# EAGLE design PCB (EAGLE 9.4.2)
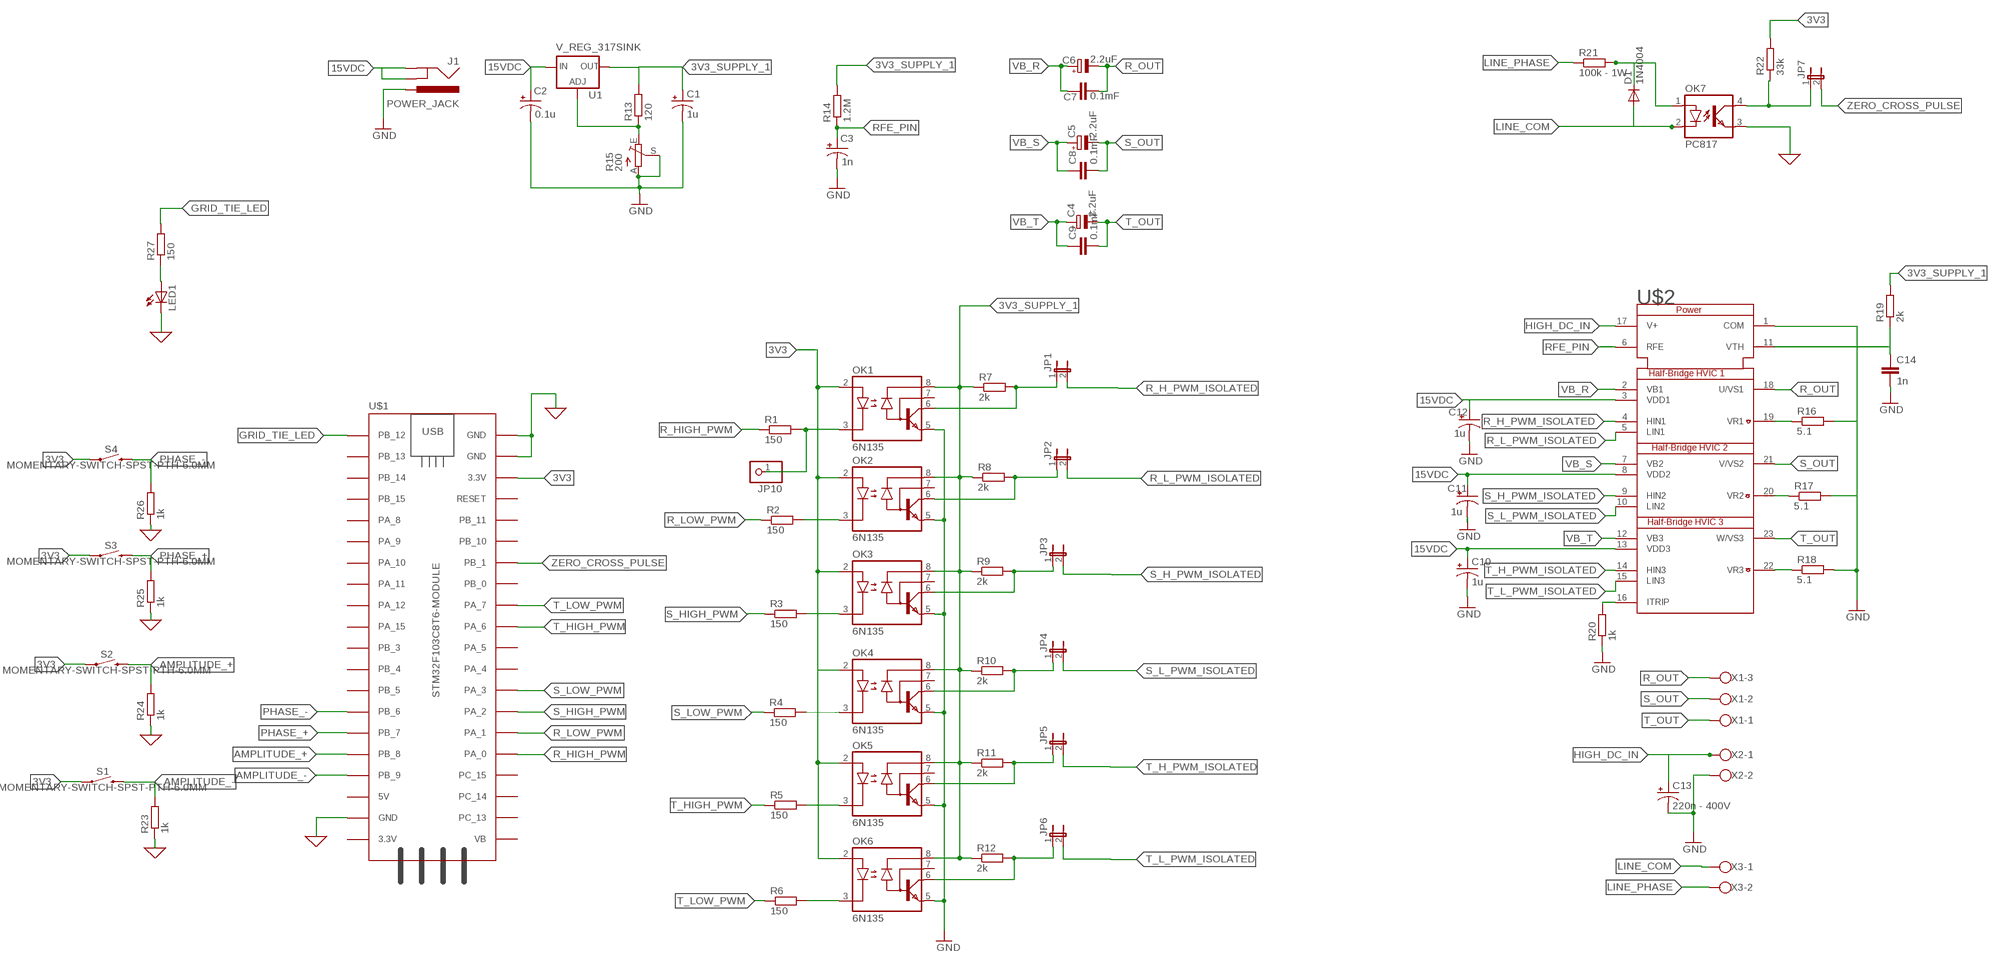
[diagram p0: schematic, sheet 1]

## Parts
C1  1u  CPOL-USE5-4  [E5-4]
C2  0.1u  CPOL-USE5-4  [E5-4]
C3  1n  CPOL-USE5-4  [E5-4]
C4  2.2uF  CPOL-EUE3.5-8  [E3,5-8]
C5  2.2uF  CPOL-EUE3.5-8  [E3,5-8]
C6  2.2uF  CPOL-EUE3.5-8  [E3,5-8]
C7  0.1mF  C5/5  [C5B5]
C8  0.1mF  C5/5  [C5B5]
C9  0.1mF  C5/5  [C5B5]
C10  1u  CPOL-USE5-4  [E5-4]
C11  1u  CPOL-USE5-4  [E5-4]
C12  1u  CPOL-USE5-4  [E5-4]
C13  220n - 400V  1000UF-RADIAL-5MM-35V-20%-KIT  [CPOL-RADIAL-5MM-10MM-KIT]
C14  1n  C5/2.5  [C5B2.5]
D1  1N4004  [DO41-10]
J1  POWER_JACK  [POWER_JACK_PTH]
JP1  JP1E  [JP1]
JP2  JP1E  [JP1]
JP3  JP1E  [JP1]
JP4  JP1E  [JP1]
JP5  JP1E  [JP1]
JP6  JP1E  [JP1]
JP7  JP1E  [JP1]
JP10  PINHD-1X1  [1X01]
LED1  LED3MM  [LED3MM]
OK1  6N135  [DIL08]
OK2  6N135  [DIL08]
OK3  6N135  [DIL08]
OK4  6N135  [DIL08]
OK5  6N135  [DIL08]
OK6  6N135  [DIL08]
OK7  PC817  [DIL04]
R1  150  R-EU_0207/10  [0207/10]
R2  150  R-EU_0207/10  [0207/10]
R3  150  R-EU_0207/10  [0207/10]
R4  150  R-EU_0207/10  [0207/10]
R5  150  R-EU_0207/10  [0207/10]
R6  150  R-EU_0207/10  [0207/10]
R7  2k  R-EU_0207/10  [0207/10]
R8  2k  R-EU_0207/10  [0207/10]
R9  2k  R-EU_0207/10  [0207/10]
R10  2k  R-EU_0207/10  [0207/10]
R11  2k  R-EU_0207/10  [0207/10]
R12  2k  R-EU_0207/10  [0207/10]
R13  120  R-EU_0207/10  [0207/10]
R14  1.2M  R-EU_0207/10  [0207/10]
R15  200  TRIM_EU-RJ9W  [RJ9W]
R16  5.1  R-EU_0207/10  [0207/10]
R17  5.1  R-EU_0207/10  [0207/10]
R18  5.1  R-EU_0207/10  [0207/10]
R19  2k  R-EU_0207/10  [0207/10]
R20  1k  R-EU_0207/10  [0207/10]
R21  100k - 1W  R-EU_0207/10  [0207/10]
R22  33k  R-EU_0207/10  [0207/10]
R23  1k  R-EU_0207/10  [0207/10]
R24  1k  R-EU_0207/10  [0207/10]
R25  1k  R-EU_0207/10  [0207/10]
R26  1k  R-EU_0207/10  [0207/10]
R27  150  R-EU_0207/10  [0207/10]
S1  MOMENTARY-SWITCH-SPST-PTH-6.0MM  [TACTILE_SWITCH_PTH_6.0MM]
S2  MOMENTARY-SWITCH-SPST-PTH-6.0MM  [TACTILE_SWITCH_PTH_6.0MM]
S3  MOMENTARY-SWITCH-SPST-PTH-6.0MM  [TACTILE_SWITCH_PTH_6.0MM]
S4  MOMENTARY-SWITCH-SPST-PTH-6.0MM  [TACTILE_SWITCH_PTH_6.0MM]
U1  V_REG_317SINK  [TO220-ADJ]
U$1  STM32F103C8T6-MODULE  [STM32F103C8T6-MODULE]
U$2  IM231-M6T2B  [DIP-IM231-M6T2B]
X1  W237-103  [W237-103]
X2  W237-102  [W237-102]
X3  W237-102  [W237-102]

## Nets
0: LED1.K(C) OK7.3(EMIT) R23.1 R24.1 R25.1 R26.1 U$1.GND_1(GND) U$1.GND_2(GND) U$1.GND_3(GND) ; supply symbol labelled GND
3V3: OK1.2(A) OK2.2(A) OK3.2(A) OK4.2(A) OK5.2(A) OK6.2(A) R22.2 S1.1 S2.1 S3.1 S4.1 U$1.3.3V_2(3.3V)
3V3_SUPPLY_1: C1.+ OK1.8(VCC) OK2.8(VCC) OK3.8(VCC) OK4.8(VCC) OK5.8(VCC) OK6.8(VCC) R7.1 R8.1 R9.1 R10.1 R11.1 R12.1 R13.2 R14.2 R19.2 U1.OUT
15VDC: C2.+ C10.+ C11.+ C12.+ J1.GND J1.GNDBREAK U1.IN U$2.3(VDD1) U$2.8(VDD2) U$2.13(VDD3)
AMPLITUDE_+: R24.2 S2.3 U$1.PB_8
AMPLITUDE_-: R23.2 S1.3 U$1.PB_9
GND: C1.- C2.- C3.- C10.- C11.- C12.- C13.- C14.2 J1.PWR OK1.5(GND) OK2.5(GND) OK3.5(GND) OK4.5(GND) OK5.5(GND) OK6.5(GND) R15.A R15.S R16.2 R17.2 R18.2 R20.1 U$2.1(COM) X2.2
GRID_TIE_LED: R27.2 U$1.PB_12
HIGH_DC_IN: C13.+ U$2.17(V+) X2.1
LINE_COM: D1.A OK7.2(C) X3.1
LINE_PHASE: R21.1 X3.2
N$2: JP10.1 OK1.3(C) R1.2
N$3: OK2.3(C) R2.2
N$4: OK3.3(C) R3.2
N$5: OK4.3(C) R4.2
N$6: OK5.3(C) R5.2
N$7: OK6.3(C) R6.2
N$9: R13.1 R15.E U1.ADJ
N$10: R20.2 U$2.16(ITRIP)
N$11: R16.1 U$2.19(VR1)
N$12: R17.1 U$2.20(VR2)
N$13: R18.1 U$2.22(VR3)
N$14: D1.C OK7.1(A) R21.2
N$15: C14.1 R19.1 U$2.11(VTH)
N$16: JP7.1 OK7.4(COL) R22.1
N$17: LED1.A R27.1
PHASE_+: R25.2 S3.3 U$1.PB_7
PHASE_-: R26.2 S4.3 U$1.PB_6
R_H_PWM_ISOLATED: JP1.2 U$2.4(HIN1)
R_HIGH_PWM: R1.1 U$1.PA_0
R_HIGH_PWM_ISOLATED: JP1.1 OK1.6(VO) R7.2
R_L_PWM_ISOLATED: JP2.2 U$2.5(LIN1)
R_LOW_PWM: R2.1 U$1.PA_1
R_LOW_PWM_ISOLATED: JP2.1 OK2.6(VO) R8.2
R_OUT: C6.- C7.2 U$2.18(U/VS1) X1.3
RFE_PIN: C3.+ R14.1 U$2.6(RFE)
S_H_PWM_ISOLATED: JP3.2 U$2.9(HIN2)
S_HIGH_PWM: R3.1 U$1.PA_2
S_HIGH_PWM_ISOLATED: JP3.1 OK3.6(VO) R9.2
S_L_PWM_ISOLATED: JP4.2 U$2.10(LIN2)
S_LOW_PWM: R4.1 U$1.PA_3
S_LOW_PWM_ISOLATED: JP4.1 OK4.6(VO) R10.2
S_OUT: C5.- C8.2 U$2.21(V/VS2) X1.2
T_H_PWM_ISOLATED: JP5.2 U$2.14(HIN3)
T_HIGH_PWM: R5.1 U$1.PA_6
T_HIGH_PWM_ISOLATED: JP5.1 OK5.6(VO) R11.2
T_L_PWM_ISOLATED: JP6.2 U$2.15(LIN3)
T_LOW_PWM: R6.1 U$1.PA_7
T_LOW_PWM_ISOLATED: JP6.1 OK6.6(VO) R12.2
T_OUT: C4.- C9.2 U$2.23(W/VS3) X1.1
VB_R: C6.+ C7.1 U$2.2(VB1)
VB_S: C5.+ C8.1 U$2.7(VB2)
VB_T: C4.+ C9.1 U$2.12(VB3)
ZERO_CROSS_PULSE: JP7.2 U$1.PB_1
Unconnected: OK1.7(VB) OK2.7(VB) OK3.7(VB) OK4.7(VB) OK5.7(VB) OK6.7(VB) U$1.3.3V_1(3.3V) U$1.5V U$1.PA_4 U$1.PA_5 U$1.PA_8 U$1.PA_9 U$1.PA_10 U$1.PA_11 U$1.PA_12 U$1.PA_15 U$1.PB_0 U$1.PB_3 U$1.PB_4 U$1.PB_5 U$1.PB_10 U$1.PB_11 U$1.PB_13 U$1.PB_14 U$1.PB_15 U$1.PC_13 U$1.PC_14 U$1.PC_15 U$1.RESET U$1.VB

## Library data of the parts
C1-C3 C10-C12 = adafruit:CPOL-US: POLARIZED CAPACITOR, American symbol
C4-C6 = resistor:CPOL-EU: POLARIZED CAPACITOR, European symbol
C7-C9 C14 = capacitor-wima:C: CAPACITOR naming: grid - package width
C13 = SparkFun-Capacitors:1000UF: 1,000µF/1mF ceramic capacitors A capacitor is a passive two-terminal electrical component used to store electrical energy temporarily in an electric field. CAP-08070; PROD_ID: CAP-09538; VALUE: 1mf
D1 = adafruit:1N4004: DIODE General purpose 1N400x type rectifier (With bigger pads) http://www.ladyada.net/library/pcb/eaglelibrary.html
J1 = SparkFun-Connectors:POWER_JACK: Power Jack Connector This is the standard 5.5mm barrel jack for power. The PTH is the most common, proven, reliable, footprint. The Slot footprint only works if the mill layer is transmitted to the PCB fab house so be warned. Here are the connectors we sell at SparkFun: DC Barrel Power Jack/Connector <https://www.sparkfun.com/products/119> (PRT-00119) DC Barrel Power Jack/Connector (SMD) <https://www.sparkfun.com/products/12748> (PRT-12748) DC Barrel Jack Adapter - Breadboard Compatible <https://www.sparkfun.com/products/10811> (PRT-10811) It is used on this SparkFun product (and many, many others): SparkFun RedBoard - Programmed with Arduino <https://www.sparkfun.com/products/12757> (DEV-12757) Also, if you need a mating power supply or connector, please check these out: Wall Adapter Power Supply - 9VDC 650mA <https://www.sparkfun.com/products/298> (TOL-00298) DC Barrel Jack Adapter - Male <https://www.sparkfun.com/products/10287> (PRT-10287); PROD_ID: CONN-08197
JP1-JP7 = jumper:JP1E: JUMPER
JP10 = adafruit:PINHD-1X1: Pin header 1x1 for 0.1" spacing With round pins
LED1 = adafruit:LED: LED OSRAM: - CHIPLED LG R971, LG N971, LY N971, LG Q971, LY Q971, LO R971, LY R971 LH N974, LH R974 LS Q976, LO Q976, LY Q976 LO Q996 - Hyper CHIPLED LW Q18S LB Q993, LB Q99A, LB R99A - SideLED LS A670, LO A670, LY A670, LG A670, LP A670 LB A673, LV A673, LT A673, LW A673 LH A674 LY A675 LS A676, LA A676, LO A676, LY A676, LW A676 LS A679, LY A679, LG A679 - Hyper Micro SIDELED® LS Y876, LA Y876, LO Y876, LY Y876 LT Y87S - SmartLED LW L88C, LW L88S LB L89C, LB L89S, LG L890 LS L89K, LO L89K, LY L89K LS L896, LA L896, LO L896, LY L896 - TOPLED LS T670, LO T670, LY T670, LG T670, LP T670 LSG T670, LSP T670, LSY T670, LOP T670, LYG T670 LG T671, LOG T671, LSG T671 LB T673, LV T673, LT T673, LW T673 LH T674 LS T676, LA T676, LO T676, LY T676, LB T676, LH T676, LSB T676, LW T676 LB T67C, LV T67C, LT T67C, LS T67K, LO T67K, LY T67K, LW E67C LS E67B, LA E67B, LO E67B, LY E67B, LB E67C, LV E67C, LT E67C LW T67C LS T679, LY T679, LG T679 LS T770, LO T770, LY T770, LG T770, LP T770 LB T773, LV T773, LT T773, LW T773 LH T774 LS E675, LA E675, LY E675, LS T675 LS T776, LA T776, LO T776, LY T776, LB T776 LHGB T686 LT T68C, LB T68C - Hyper Mini TOPLED® LB M676 - Mini TOPLED Santana® LG M470 LS M47K, LO M47K, LY M47K Source: http://www.osram.convergy.de/
OK1-OK6 = optocoupler:6N135: MOTOROLA OPTO COUPLER; MF: FAIRCHILD SEMICONDUCTOR; MPN: 6N135; OC_FARNELL: 1021342; OC_NEWARK: 58K9658
OK7 = optocoupler:PC817: SHARP OPTO COUPLER; MPN: PC817X4J000F; OC_FARNELL: 9707727; OC_NEWARK: 97K7059
R1-R14 R16-R27 = rcl:R-EU_: RESISTOR, European symbol; SPICEPREFIX: R
R15 = pot:TRIM_EU-: POTENTIOMETER
S1-S4 = SparkFun-Switches:MOMENTARY-SWITCH-SPST: Momentary Switch (Pushbutton) - SPST Normally-open (NO) SPST momentary switches (buttons, pushbuttons). Variants PTH-12MM - 12mm square, through-hole Momentary Pushbutton Switch - 12mm Square <https://www.sparkfun.com/products/9190> (COM-09190) PTH-6.0MM, PTH-6.0MM-KIT - 6.0mm square, through-hole Mini Pushbutton Switch <https://www.sparkfun.com/products/97> (COM-00097) KIT package intended for soldering kit's - only one side of pads' copper is exposed. PTH-RIGHT-ANGLE-KIT - Right-angle, through-hole Right Angle Tactile Button <https://www.sparkfun.com/products/10791> - Used on SparkFun BigTime Watch Kit <https://www.sparkfun.com/products/11734> SMD-12MM - 12mm square, surface-mount Tactile Button - SMD (12mm) <https://www.sparkfun.com/products/12993> (COM-12993) Used on SparkFun PicoBoard <https://www.sparkfun.com/products/11888> SMD-4.5MM - 4.5mm Square Trackball Switch Used on SparkFun Blackberry Trackballer Breakout <https://www.sparkfun.com/products/13169> SMD-4.6MMX2.8MM - 4.60mm x 2.80mm, surface mount Used on SparkFun SAMD21 Mini Breakout <https://www.sparkfun.com/products/13664> SMD-5.2MM, SMD-5.2-REDUNDANT - 5.2mm square, surface-mount Mini Pushbutton Switch - SMD <https://www.sparkfun.com/products/8720> (COM-08720) Used on Arduino Pro Mini <https://www.sparkfun.com/products/11114> REDUNDANT package connects both switch circuits together SMD-6.0X3.5MM - 6.0 x 3.5mm, surface mount Momentary Reset Switch SMD <https://www.sparkfun.com/products/8229> (COM-08229) SMD-6.2MM-TALL - 6.2mm square, surface mount Tactile Button - SMD (6mm) <https://www.sparkfun.com/products/12992> Used on SparkFun Digital Sandbox <https://www.sparkfun.com/products/12651> SMD-RIGHT-ANGLE - Right-angle, surface mount Used on SparkFun Block for Intel® Edison - Arduino <https://www.sparkfun.com/products/13036>; PROD_ID: SWCH-08441; SF_SKU: COM-00097
U1 = SparkFun-IC-Power:V_REG_317: Voltage Regulator Standard LM317 adjustable voltage regulator. AOI (Adjust Output Input). Google 'LM317 Calculator' for easy to use app to get the two resistor values needed. 240/720 for 5V output. 240/390 for 3.3V output. Spark Fun Electronics SKU : COM-00527
U$1 = stm32f103c8t6_module:STM32F103C8T6-MODULE: STM32F103C8T6 module with ARM Cortex-3, 20kB SRAM, 64kB Flash, 72MHz
U$2 = IM231-M6T2B:IM231-M6T2B: IM231-M6T2B CIPOS Micro IPM 600V/4A DIP-IM231-M6T2B
X1 = con-wago-500:W237-103: WAGO SCREW CLAMP; MPN: 237-103; OC_FARNELL: unknown; OC_NEWARK: 18M7116
X2 X3 = con-wago-500:W237-102: WAGO SCREW CLAMP; MPN: 237-102; OC_FARNELL: unknown; OC_NEWARK: 70K9898

## Board
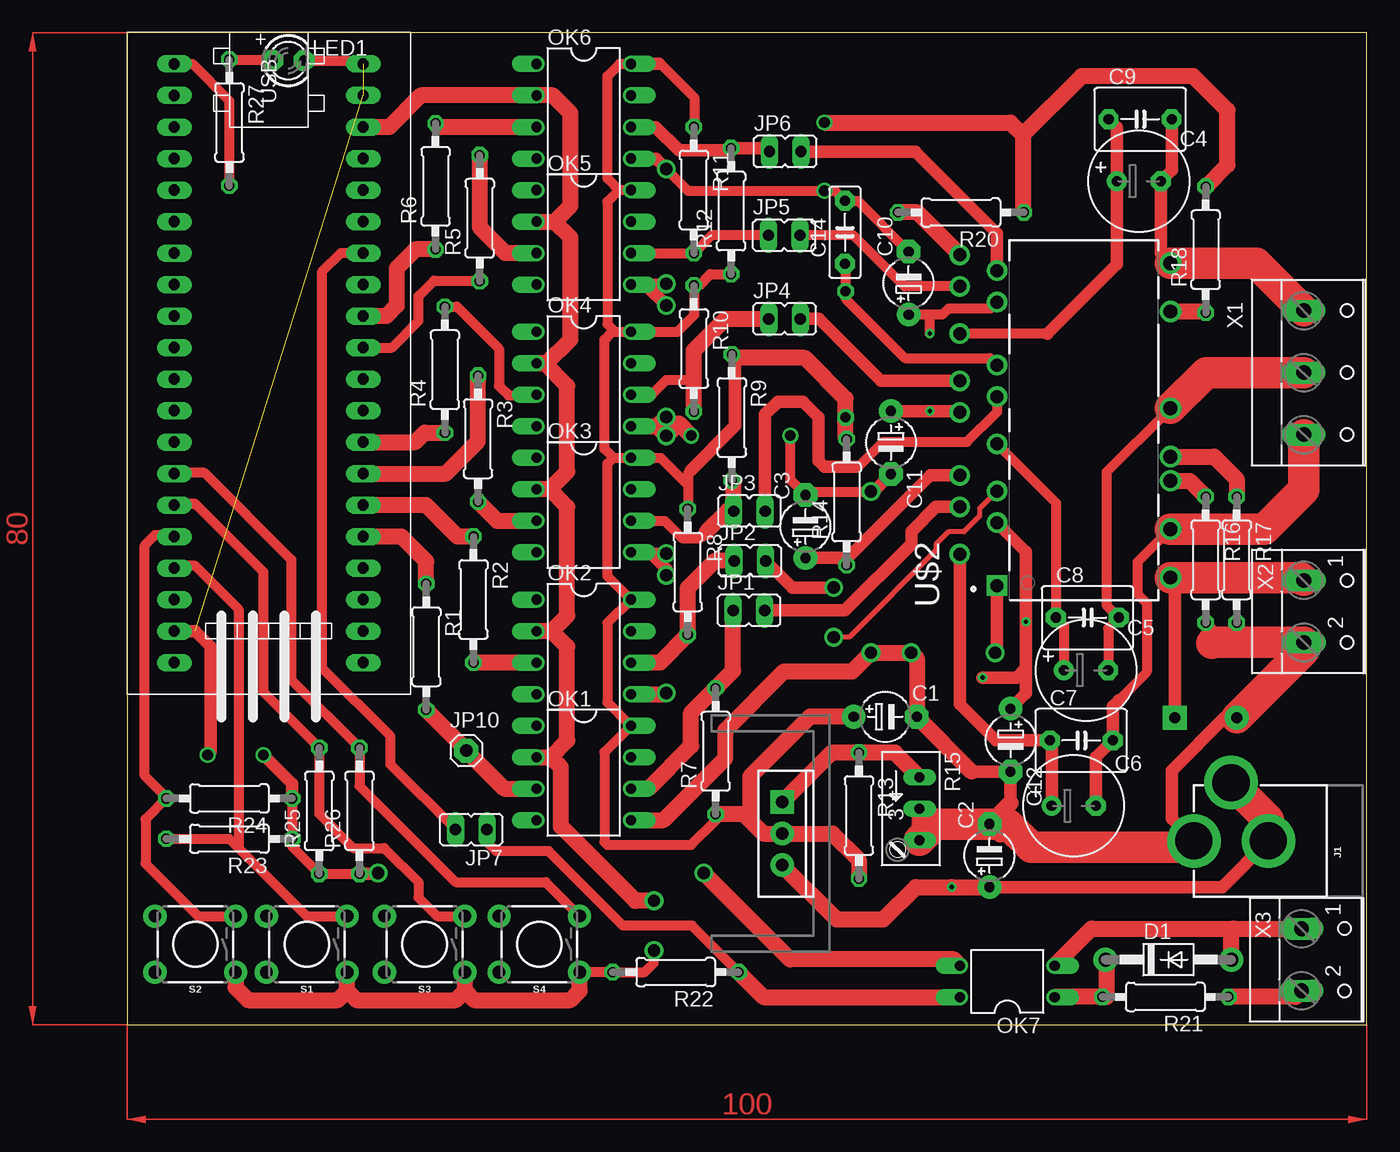
[diagram p1: board, top side]
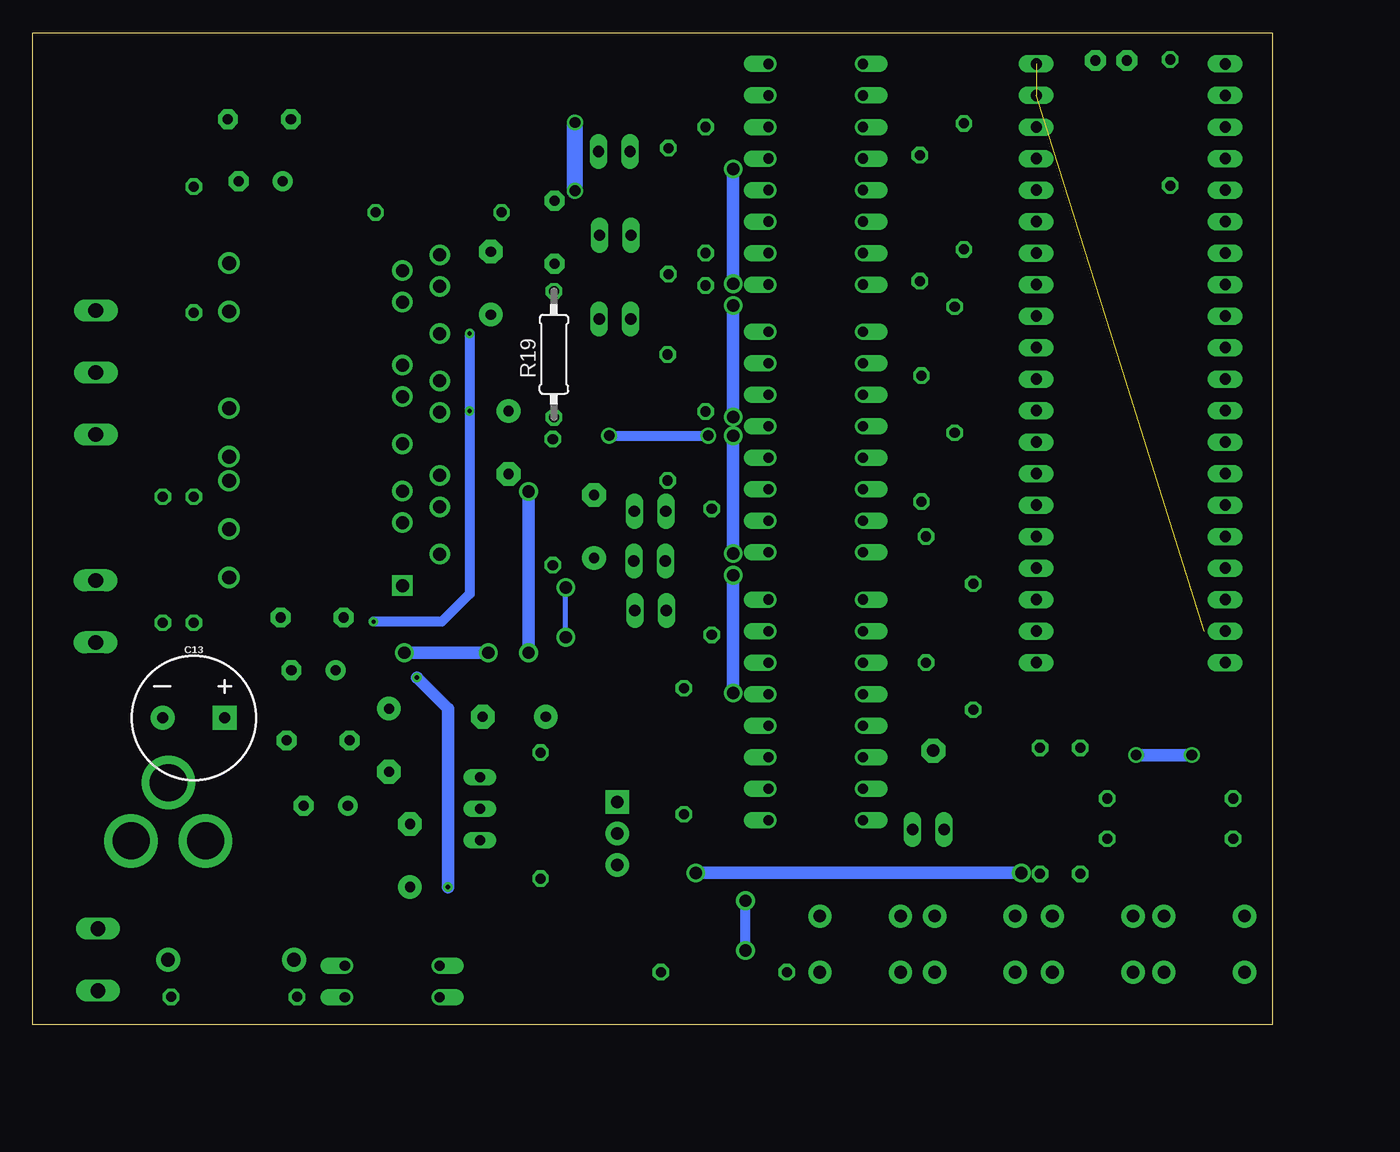
[diagram p2: board, bottom side, seen from below]

Size 100 x 80 mm. Coordinates in mm from the lower left corner, seen from the top.
Outline: 0,0 100,0 100,80 0,80 0,0
Copper layers (1*16): Top 0.035mm / dielectric 1.5mm / Bottom 0.035mm
Design rules "default": minimum track width 6mil, minimum drill 0.35mm, track to track 6mil, track to pad 6mil, pad to pad 6mil, via to via 6mil, smd to smd 6mil, copper to edge 40mil, drill to drill 6mil, minimum pad ring 10mil, minimum via ring 8mil, stop-mask expansion 4mil, vias tented up to drill 0mil, thermal gap 10mil

### Footprints (pad centres in the part's own frame; a part is rotated, then mirrored left to right if it is on the bottom)
E5-4 = drill 0.813 pad 1.905: + -2.54,0 | drill 0.813 pad 1.905 octagon: - 2.54,0
E3,5-8 = drill 0.813 pad 1.6: + -1.778,0 | drill 0.813 pad 1.6 octagon: - 1.778,0
C5B5 = drill 0.813 pad 1.6 octagon: 1 -2.54,0; 2 2.54,0
CPOL-RADIAL-5MM-10MM-KIT = drill 0.9 pad 1.93 square: + 2.5,0 | drill 0.9 pad 1.93: - -2.5,0
C5B2.5 = drill 0.813 pad 1.6 octagon: 1 -2.54,0; 2 2.54,0
DO41-10 = drill 1.118 pad 1.93: A 5.08,0; C -5.08,0
POWER_JACK_PTH = drill 2.997 pad 4.318: GND 0,7.7; GNDBREAK 4.7,10.7; PWR 0,13.7
JP1 = drill 0.914 long: 1 0,-1.27; 2 0,1.27
1X01 = drill 1.016 pad 1.93 octagon: 1 0,0
LED3MM = drill 0.813 pad 1.676 octagon: A -1.27,0; K 1.27,0
DIL08 = drill 0.813 offset: 1 -3.81,-3.81; 2 -1.27,-3.81; 3 1.27,-3.81; 4 3.81,-3.81; 5 3.81,3.81; 6 1.27,3.81; 7 -1.27,3.81; 8 -3.81,3.81
DIL04 = drill 0.813 offset: 1 -1.27,-3.81; 2 1.27,-3.81; 3 1.27,3.81; 4 -1.27,3.81
0207/10 = drill 0.813 octagon: 1 -5.08,0; 2 5.08,0
RJ9W = drill 0.813 long: A 2.54,0.635; E -2.54,0.635; S 0,0.635
TACTILE_SWITCH_PTH_6.0MM = drill 1.016 pad 1.88: 1 -3.251,2.261; 2 3.251,2.261; 3 -3.251,-2.261; 4 3.251,-2.261
TO220-ADJ = drill 1 pad 1.88 square: ADJ -2.54,0 | drill 1 pad 1.88: IN 2.54,0; OUT 0,0
STM32F103C8T6-MODULE = drill 0.9 long: 3.3V_1 25.4,-7.62; 3.3V_2 -17.78,7.62; 5V 20.32,-7.62; GND_1 22.86,-7.62; GND_2 -20.32,7.62; GND_3 -22.86,7.62; PA_0 15.24,7.62; PA_1 12.7,7.62; PA_2 10.16,7.62; PA_3 7.62,7.62; PA_4 5.08,7.62; PA_5 2.54,7.62; PA_6 0,7.62; PA_7 -2.54,7.62; PA_8 -12.7,-7.62; PA_9 -10.16,-7.62; PA_10 -7.62,-7.62; PA_11 -5.08,-7.62; PA_12 -2.54,-7.62; PA_15 0,-7.62; PB_0 -5.08,7.62; PB_1 -7.62,7.62; PB_3 2.54,-7.62; PB_4 5.08,-7.62; PB_5 7.62,-7.62; PB_6 10.16,-7.62; PB_7 12.7,-7.62; PB_8 15.24,-7.62; PB_9 17.78,-7.62; PB_10 -10.16,7.62; PB_11 -12.7,7.62; PB_12 -22.86,-7.62; PB_13 -20.32,-7.62; PB_14 -17.78,-7.62; PB_15 -15.24,-7.62; PC_13 22.86,7.62; PC_14 20.32,7.62; PC_15 17.78,7.62; RESET -15.24,7.62; VB 25.4,7.62
DIP-IM231-M6T2B = drill 1.05 pad 1.65 square: 1 -13.335,5.5 | drill 1.05 pad 1.65: 2 -10.795,8.5; 3 -8.255,5.5; 4 -6.985,8.5; 5 -5.715,5.5; 6 -4.445,8.5; 7 -1.905,5.5; 8 0.635,8.5; 9 1.905,5.5; 10 3.175,8.5; 11 4.445,5.5; 12 6.985,8.5; 13 9.525,5.5; 14 10.795,8.5; 15 12.065,5.5; 16 13.335,8.5 | drill 1.12 pad 1.72: 17 -12.675,-8.5; 18 -8.775,-8.5; 19 -4.875,-8.5; 20 -2.925,-8.5; 21 0.975,-8.5; 22 8.775,-8.5; 23 12.675,-8.5
W237-103 = drill 1.194 long: 1 -5,-1.29; 2 0,-1.29; 3 5,-1.29
W237-102 = drill 1.194 long: 1 -2.5,-1.27; 2 2.5,-1.27

### Placement (x,y rotation side)
C1  61.15,24.84 0 top
C2  69.56,13.65 90 top
C3  54.72,40.18 90 top
C4  81.6,68.02 0 top
C5  77.35,28.59 0 top
C6  76.35,17.66 0 top
C7  76.96,22.93 0 top
C8  77.46,32.84 0 top
C9  81.71,73.02 0 top
C10  63.04,59.8 90 top
C11  61.61,46.95 270 top
C12  71.26,22.95 270 top
C13  87,24.75 0 bottom
C14  57.9,63.9 90 top
D1  84,5.25 0 top
J1  99.75,14.83 90 top
JP1  50.15,33.41 270 top
JP2  50.23,37.41 270 top
JP3  50.2,41.41 270 top
JP4  53.03,56.91 270 top
JP5  53,63.66 270 top
JP6  53.08,70.41 270 top
JP7  27.75,15.75 90 top
JP10  27.36,22.11 0 top
LED1  13,77.75 0 top
OK1  36.83,20.32 270 top
OK2  36.83,30.48 270 top
OK3  36.83,41.91 270 top
OK4  36.83,52.07 270 top
OK5  36.83,63.5 270 top
OK6  36.83,73.66 270 top
OK7  71,3.5 90 top
R1  24.13,30.48 270 top
R2  27.94,34.29 270 top
R3  28.31,47.26 270 top
R4  25.63,52.82 90 top
R5  28.44,65.04 90 top
R6  24.88,67.6 90 top
R7  47.47,22.06 90 top
R8  45.22,36.52 270 top
R9  48.78,48.97 270 top
R10  45.72,54.53 270 top
R11  45.72,67.31 270 top
R12  48.72,65.61 90 top
R13  59.03,16.87 270 top
R14  58.04,42.15 90 top
R15  63.28,17.43 270 top
R16  87,37.5 270 top
R17  89.5,37.5 270 top
R18  87,62.5 90 top
R19  57.95,54.06 270 bottom
R20  67.25,65.5 180 top
R21  83.75,2.25 180 top
R22  44.25,4.25 180 top
R23  8.25,15 180 top
R24  8.25,18.25 180 top
R25  15.5,17.25 90 top
R26  18.75,17.25 90 top
R27  8.25,72.75 270 top
S1  14.5,6.5 180 top
S2  5.5,6.5 180 top
S3  24,6.5 180 top
S4  33.25,6.5 180 top
U1  52.84,15.42 270 top
U$1  11.43,54.61 270 top
U$2  75.66,48.74 90 top
X1  96.19,52.59 270 top
X2  96.19,33.33 270 top
X3  96,5.25 270 top

### Tracks (layer width: path | path; a pad name or v marks a point on that pad's centre or on a via)
0  (via drill 0.85, 1)  (2 unrouted)
  Top 0.813: R24.1 R23.1 13.33,14.34 R25.1 R26.1 | LED1.K 18.77,77.75 U$1.GND_3
  Top 1.016: R24.1 13.33,19.42 v11,21.75 | v6.5,21.75 6.75,22 6.75,30.5 5.5,31.75 U$1.GND_1 | R26.1 20.17,12.17 v20.25,12.25
  Top 1.27: OK7.3 66.69,5.27 53.48,5.27 v46.5,12.25
  Bottom 1.016: v11,21.75 v6.5,21.75 | v20.25,12.25 v46.5,12.25
3V3  (via drill 1)
  Top 0.813: S4.1 39.16,4.24 R22.2 41.75,4.25 42.5,5 v42.5,6
  Top 1.27: v42.5,10 41.01,10 35,16.01 35,20.75 34.16,21.59 | OK1.2 34.16,21.59 | 34.16,21.59 35.5,22.93 35.5,30.5 34.25,31.75 | 34.25,31.75 OK2.2 | 34.25,31.75 35.5,33 35.5,41.75 34.07,43.18 | 34.07,43.18 OK3.2 | 34.07,43.18 35.5,44.61 35.5,51.5 33.66,53.34 OK4.2 33.84,53.34 35.75,55.25 35.75,63.5 34.48,64.77 | OK5.2 34.48,64.77 | 34.48,64.77 35.75,66.04 35.75,73.5 34.32,74.93 OK6.2 23.68,74.93 21.14,72.39 U$1.3.3V_2 | S2.1 8.75,3 9.75,2 17,2 17.75,2.75 | 17.75,2.75 S1.1 | 17.75,2.75 18.5,2 26.5,2 27.25,2.75 | 27.25,2.75 S3.1 | 27.25,2.75 28,2 35.75,2 36.5,2.75 S4.1
  Bottom 0.813: v42.5,6 v42.5,10
3V3_SUPPLY_1
  Top 0.813: R11.1 45.75,72.42 45.75,74.75 43.03,77.47 OK6.8 40.61,77.5 39.75,77.5 38.75,76.5 38.75,68.25 39.69,67.31 | OK5.8 39.69,67.31 | 39.69,67.31 38.75,66.37 38.75,56.5 39.37,55.88 | 39.37,55.88 OK4.8 44.38,55.88 45.75,57.25 45.75,59.58 R10.1 46.11,59.61 47.03,60.53 R12.1 | 45.25,43.75 45.25,41.63 R8.1 | 39.22,45.72 38.75,45.25 38.75,36.18 OK2.8 38.75,32.4 38.75,26 40.62,24.13 OK1.8 38.5,21.99 38.5,14.75 38.75,14.5 45.5,14.5 47.47,16.47 R7.1 | 39.22,45.72 OK3.8 43.03,45.72 45,43.75 45.25,43.75 | 39.22,45.72 38.5,46.44 38.5,55.25 39.13,55.88 39.37,55.88 | 49.05,53.73 54.7,53.73 | 45.47,44.72 45.25,44.5 45.25,43.75
  Top 1.016: 42.89,77.47 OK6.8 | 49.05,52.48 49.03,52.5 | 49.05,52.48 49.05,53.73 49.05,53.78 R9.1 | 45.47,44.72 49.05,48.3 49.05,52.48
  Top 1.27: R14.2 57.95,47.32 R19.2 57.95,50.48 54.7,53.73 54.65,53.78 49.05,53.78 | C1.+ 55.09,24.84 50.25,20 50.25,16.5 | R7.1 49.77,16.98 50.25,16.5 | 50.25,16.5 51.33,15.42 U1.OUT 56.9,15.42 59.03,13.29 R13.2
15VDC  (via drill 0.35)
  Top 0.813: v66.5,11.11 C2.+ 69.75,11.11 | U$2.13 69.64,57.75 66.25,57.75 65.76,57.26 64.75,57.26 | v64.75,55.75 64.75,57.26 | 64.75,57.26 C10.+
  Top 1.016: C2.+ 88.33,11.11 J1.GND | U$2.3 72.5,38.15 v72.5,32.5 72.5,28.75 | 72.5,28.75 72.5,26.73 C12.+ | 72.5,28.75 71.75,28 v69,28 | C11.+ v64.75,49.49 67.05,49.49 U$2.8
  Top 1.27: U1.IN 57.22,8.5 61,8.5 63.61,11.11 v66.5,11.11 69.75,11.11
  Top 2.54: J1.GNDBREAK 92.05,16.53 J1.GND
  Bottom 0.813: v64.75,55.75 v64.75,49.49 64.75,34.75 67,32.5 v72.5,32.5
  Bottom 1.016: v69,28 66.5,25.5 v66.5,11.11
AMPLITUDE_+
  Top 0.813: S2.3 5.75,8.75 1.5,13 1.5,16.58 R24.2 3.17,18.33 1.42,20.08 1.42,38.67 2.25,39.5 3.68,39.5 U$1.PB_8
AMPLITUDE_-
  Top 0.813: R23.2 8.25,15 9,14.25 | 9,14.25 14.5,8.75 S1.3 | U$1.PB_9 3.98,37 5.5,37 9,33.5 9,14.25
GND  (via drill 0.85, 1, 1 pad 1.3)
  Top 0.813: C14.2 57.09,67.25 v56.25,67.25 45.25,67.25 v43.5,69 | 58.56,66.44 C14.2 | v53.5,47.5 53.5,43.94 C3.- 55,43 60.2,43 | R16.2 87.58,31.84 87.58,30.83 | R17.2 89.5,30.83 | C14.2 58.94,66.44 C10.-
  Top 1.016: 54.69,42.75 C3.- | U$2.1 70.16,30.16 v70,30 | v43.5,59.75 43.44,59.69 OK5.5 41.81,59.69 v43.5,58 | v43.5,69 42.65,69.85 OK6.5 | v43.5,36.25 43.5,36.75 42.15,38.1 OK3.5 40.74,38 v43.5,38 | v60,43 60.2,43 C11.- | C13.- 88.5,24.75 84.25,20.5 84.25,16.63 J1.PWR | 71.26,17.89 C12.- 68.12,20.41
  Top 1.27: R18.2 88.75,69.33 88.75,73.75 86,76.5 77,76.5 72.25,71.75 | 72.25,71.75 72.25,65.58 R20.1 | v56.25,72.75 71.25,72.75 72.25,71.75 | 70.42,15.33 C2.- | 71.26,17.89 C2.- | 68.12,20.41 C1.- 63.69,29.56 v63.25,30 v60,30 58.5,28.5 53,28.5 48.25,23.75 48.25,21.5 43.26,16.51 OK1.5 | C2.- 65.16,16.19 R15.S R15.A | v43.5,49 42.76,48.26 OK4.5 42.74,48.26 v43.5,47.5 44.5,48.5 v45.5,47.5 | OK2.5 43.42,26.67 v43.5,26.75
  Top 2.54: C13.- 94.92,30.17 X2.2 89.5,30.83 87.58,30.83 87.5,30.75 | R15.A 65.22,16.19 C2.- 71.06,16.19 72.92,14.33 85.55,14.33 J1.PWR
  Bottom 0.813: v53.5,47.5 v45.5,47.5
  Bottom 1.016: v70,30 v63.25,30 | v43.5,59.75 v43.5,69 | v43.5,58 v43.5,49 | v43.5,26.75 v43.5,36.25 | v43.5,47.5 v43.5,38 | v60,43 v60,30
  Bottom 1.27: v56.25,67.25 v56.25,72.75
GRID_TIE_LED
  Top 0.813: U$1.PB_12 5.28,77.47 8.25,74.5 R27.2
HIGH_DC_IN
  Top 1.016: U$2.17 84.5,35.73 C13.+
  Top 2.54: U$2.17 94.69,36.06 X2.1
LINE_COM
  Top 0.152: 89.08,7.58 89.25,7.75
  Top 1.27: OK7.2 77.79,7.75 89.25,7.75 X3.1 | D1.A 89.08,7.58
LINE_PHASE
  Top 1.27: X3.2 94.23,2.25 R21.1
N$2
  Top 1.27: R1.2 27.36,22.17 JP10.1 30.42,19.05 OK1.3
N$3
  Top 1.27: OK2.3 R2.2
N$4
  Top 1.27: R3.2 29.85,40.64 OK3.3
N$5
  Top 0.813: R4.2 26.6,57.9 30,54.5 30,51.5 30.75,50.75 32.97,50.75 OK4.3
N$6
  Top 1.27: R5.2 28.44,64.31 30.52,62.23 OK5.3
N$7
  Top 1.27: OK6.3 25.17,72.39 R6.2
N$9
  Top 1.27: R15.E 61.94,21.95 R13.1 56.83,21.95 U1.ADJ
N$10
  Top 1.27: U$2.16 63.73,65.5 R20.2
N$11
  Top 1.27: U$2.19 85.72,43.87 R16.1
N$12
  Top 1.27: U$2.20 87.69,45.81 89.5,44 R17.1
N$13
  Top 0.813: 86.91,57.52 R18.1
  Top 1.27: U$2.22 86.91,57.52
N$14
  Top 0.152: R21.2 78.5,2.25 | 74.83,2.25 OK7.1
  Top 1.27: 74.83,2.25 78.5,2.25 79,2.25 79,5.17 D1.C
N$15
  Top 0.813: C14.1 57.95,61.31 R19.1 57.95,58.55 62.75,53.75 69.59,53.75 U$2.11
N$16
  Top 0.813: R22.1 45.58,8 40,8 34,14 29.75,14 29.02,14.73 JP7.1
  Top 1.27: R22.1 51.35,2.23 OK7.4
N$17
  Top 0.813: R27.1 11.65,77.83 LED1.A
PHASE_+
  Top 0.813: S3.3 24.99,8.76 23.5,10.25 23.5,11.5 20.75,14.25 18.25,14.25 15.5,17 R25.2 11,26.83 11,36.5 6.25,41.25 5.5,42 | 5.5,42 3.9,42 | U$1.PB_7 3.9,42 | 3.9,42 5.5,42
PHASE_-
  Top 0.813: S4.3 33.76,11.5 26.5,11.5 18.75,19.25 R26.2 13.25,27.83 13.25,37.5 6.25,44.5 3.86,44.5 U$1.PB_6
R_H_PWM_ISOLATED
  Top 1.016: U$2.4 65.25,41.76 63.25,39.75 63.25,38.75 57.91,33.41 JP1.2
R_HIGH_PWM
  Top 1.27: R1.1 24.13,37.37 22.13,39.37 U$1.PA_0
R_HIGH_PWM_ISOLATED
  Top 1.27: OK1.6 42.05,19.05 45.5,22.5 45.5,25.17 R7.2 48.88,28.55 JP1.1
R_L_PWM_ISOLATED  (via drill 1)
  Top 0.406: U$2.5 68.75,41.62 68.75,41 67.5,39.75 66.25,39.75 65.25,38.75 65.25,38.25 58.25,31.25 v57,31.25
  Top 1.016: v57,35.25 53.66,35.25 JP2.2
  Bottom 0.406: v57,31.25 v57,35.25
R_LOW_PWM
  Top 1.27: U$1.PA_1 24.11,41.91 26.65,39.37 R2.1
R_LOW_PWM_ISOLATED
  Top 1.27: JP2.1 47.41,37.41 45.22,35.22 R8.2 42.99,29.21 OK2.6
R_OUT
  Top 0.813: 80,26.18 82.25,28.43 82.25,34 81.5,34.75 81.5,37.3 U$2.18
  Top 1.016: C6.- 78.13,21.56 C7.2 79.5,25.68 80,26.18
  Top 2.54: U$2.18 91.72,39.97 94.9,43.15 X1.3
RFE_PIN
  Top 1.016: U$2.6 64.8,44.3 58.04,37.54 R14.1 57.47,37.64 C3.+
S_H_PWM_ISOLATED
  Top 0.813: U$2.9 70.16,49.41 67.75,47 61,47 59,45 58.75,45
  Top 1.016: JP3.2 51.47,49.22 52.5,50.25 54.5,50.25 55.75,49 55.75,45.5 56.25,45 58.75,45
S_HIGH_PWM
  Top 1.27: U$1.PA_2 25.7,44.45 28.31,47.06 R3.1
S_HIGH_PWM_ISOLATED
  Top 0.813: 48.41,41.41 JP3.1 | 48.93,43.74 R9.2 | OK3.6 43.36,40.64 44.75,39.25 46.25,39.25 46.75,39.75
  Top 1.27: 46.75,39.75 48.41,41.41 | JP3.1 48.93,43.74
S_L_PWM_ISOLATED
  Top 0.813: U$2.10 61.84,51.91
  Top 1.016: JP4.2 55.8,56.91 60.8,51.91 U$2.10
S_LOW_PWM
  Top 1.27: U$1.PA_3 23.24,46.99 24,47.75 R4.1
S_LOW_PWM_ISOLATED
  Top 0.813: OK4.6 42.3,50.8 43.5,52 45.72,52
  Top 1.27: R10.2 45.72,52 45.72,54.37 48.26,56.91 JP4.1
S_OUT
  Top 0.813: C5.- 79.13,31.97 C8.2 79,33.84 79,44.55 83.97,49.53
  Top 1.27: U$2.21 83.97,49.53
  Top 2.54: X1.2 87.03,52.59 U$2.21
T_H_PWM_ISOLATED
  Top 0.813: U$2.14 62.72,59.53 58.59,63.66 JP5.2
T_HIGH_PWM
  Top 0.813: U$1.PA_6 21.36,54.61 23.5,56.75 23.5,58.75 24.75,60 28.4,60 R5.1
T_HIGH_PWM_ISOLATED
  Top 0.813: OK5.6 R11.2 47.15,63.66 JP5.1
T_L_PWM_ISOLATED
  Top 1.016: U$2.15 70.16,63.84 63.59,70.41 JP6.2
T_LOW_PWM
  Top 1.27: R6.1 23.27,62.52 21.75,61 21.75,58 20.9,57.15 U$1.PA_7
T_LOW_PWM_ISOLATED
  Top 0.813: 48.62,70.41 48.53,70.5
  Top 1.016: OK6.6 42.61,72.39 44.5,70.5 48.53,70.5 R12.2 51.53,70.69 JP6.1
T_OUT
  Top 0.813: U$2.23 84.25,61.5
  Top 1.016: C9.2 84.25,68.89 C4.- 83.38,62.2 U$2.23
  Top 2.54: X1.1 91.08,61.41 U$2.23
VB_R
  Top 1.016: 67.25,37.85 U$2.2 67.16,25.84 70.07,22.93 C7.1 74.57,22.78 C6.+
VB_S
  Top 0.813: U$2.7 74.92,42.08 C8.1 75.57,32.19 C5.+
VB_T
  Top 0.813: 74.22,55.73 U$2.12
  Top 1.016: C9.1 79.82,72.37 C4.+ 79.82,61.32 74.22,55.73
ZERO_CROSS_PULSE
  Top 0.813: U$1.PB_1 19.03,62.25 17.25,62.25 15.75,60.75 15.75,28.75 21.25,23.25 21.25,20.98 JP7.2
(copper drawn outside any net)
  shapes: Top area x2